# EAGLE design badge_03v3 (EAGLE 7.2.0)
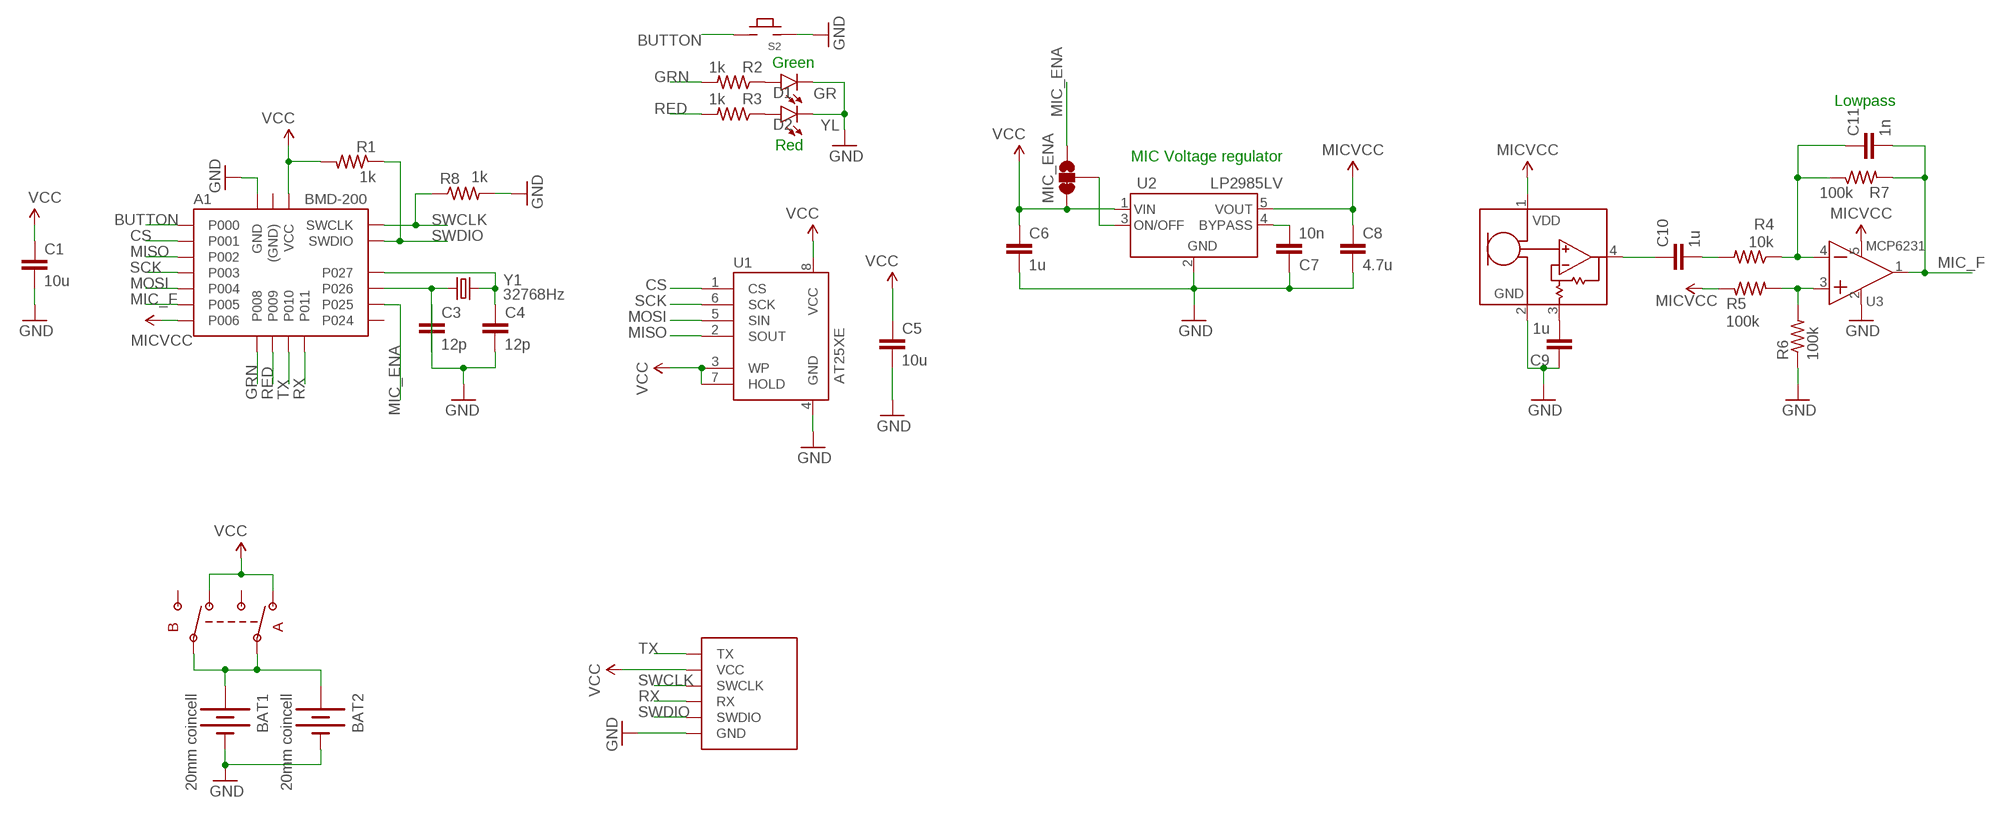
[diagram p0: schematic, sheet 1]

## Parts
A1  BMD-200  [BMD-200]
BAT1  20mm coincell  BATTERY20MM_ISO  [BATTCON_20MM_4LEGS_ISO]
BAT2  20mm coincell  BATTERY20MM_ISO_NOCREAM  [BATTCON_20MM_4LEGS_ISO_NOCREAM]
C1  10u  C-EUC0603  [C0603]
C3  12p  C-EUC0603  [C0603]
C4  12p  C-EUC0603  [C0603]
C5  10u  C-EUC0603  [C0603]
C6  1u  C-EUC0603  [C0603]
C7  10n  C-EUC0603  [C0603]
C8  4.7u  C-EUC0603  [C0603]
C9  1u  C-EUC0603  [C0603]
C10  1u  C-EUC0603  [C0603]
C11  1n  C-EUC0603  [C0603]
D1  GR  LED  [LED-0603]
D2  YL  LED  [LED-0603]
J1  PROG_CONN_6  [TH_CONN_6]
MIC_ENA  JUMPER-PAD-3-2OF3_NC_BY_TRACE_SMALL  [PAD-JUMPER-3-2OF3_NC_BY_TRACE_YES_SILK_FULL_BOX]
MK1  SPU0414(AMP)  [MIC_SPU041X]
R1  1k  R-US_R0603  [R0603]
R2  1k  R-US_R0603  [R0603]
R3  1k  R-US_R0603  [R0603]
R4  10k  R-US_R0603  [R0603]
R5  100k  R-US_R0603  [R0603]
R6  100k  R-US_R0603  [R0603]
R7  100k  R-US_R0603  [R0603]
R8  1k  R-US_R0603  [R0603]
S1  JS202011SCQN  [JS202011SCQN]
S2  TACT6MM4  [TACT1]
U1  AT25XE  AT25_SOIC  [SOIC8]
U2  LP2985LV  [SOT23-5L]
U3  MCP6231  [SOT23-5L]
Y1  32768Hz  CRYSTAL  [CRYSTAL_2SMD]

## Nets
BUTTON: A1.P$11(P000) S2.1 S2.2
CS: A1.P$12(P001) U1.1(CS)
GND: A1.P$1(GND) A1.P$2(GND) A1.P$3(GND) A1.P$4(GND) A1.P$7(GND) A1.P$10(GND) A1.P$19(GND) A1.P$26(GND) BAT1.NEG(-) BAT2.NEG(-) C1.2 C3.1 C4.2 C5.2 C6.2 C7.1 C8.2 C9.1 D1.C D2.C J1.GND MK1.2(GND) R6.1 R8.2 S2.3 S2.4 U1.4(GND) U2.2(GND) U3.2(GND)
GRN: A1.P$20(P008) R2.2
MIC_ENA: A1.P$6(P025) MIC_ENA.1
MIC_F: A1.P$16(P005) C11.2 R7.2 U3.1(O)
MICVCC: A1.P$17(P006) C8.1 MK1.1(VDD) R5.1 U2.5(VOUT) U3.5(VDD)
MISO: A1.P$13(P002) U1.2(SOUT)
MOSI: A1.P$15(P004) U1.5(SIN)
N$2: A1.P$8(P026) C3.2 Y1.P$2
N$3: D1.A R2.1
N$4: D2.A R3.1
N$6: MIC_ENA.2 U2.3(ON/OFF)
N$7: C9.2 MK1.3(GAIN)
N$8: A1.P$9(P027) C4.1 Y1.P$1
N$9: C7.2 U2.4(BYPASS)
N$10: R5.2 R6.2 U3.3(+)
N$11: C10.1 MK1.4(OUT)
N$13: C10.2 R4.2
N$14: C11.1 R4.1 R7.1 U3.4(-)
RED: A1.P$21(P009) R3.2
RX: A1.P$23(P011) J1.RX
SCK: A1.P$14(P003) U1.6(SCK)
SWCLK: A1.P$25(SWCLK) J1.SWCLK R8.1
SWDIO: A1.P$24(SWDIO) J1.SWDIO R1.1
TX: A1.P$22(P010) J1.TX
VBATT: BAT1.1(+) BAT1.2(+) BAT1.3(+) BAT1.4(+) BAT2.1(+) BAT2.2(+) BAT2.3(+) BAT2.4(+) S1.AC S1.BC
VCC: A1.P$18(VCC) C1.1 C5.1 C6.1 J1.VCC MIC_ENA.3 R1.2 S1.A1 S1.B1 U1.3(WP) U1.7(HOLD) U1.8(VCC) U2.1(VIN)
Unconnected: A1.P$5(P024) A1.P$27((GND)) A1.P$28((GND)) S1.A2 S1.B2

## Notes on the sheet
- Green
- Lowpass
- Red
- MIC Voltage regulator

## Library data of the parts
A1 = rigado_BMD-200:BMD-200
BAT1 BAT2 = Badge:BATTERY: Battery Holders Various common sizes : AA, AAA, 18650 (PRT-12895), 20mm coin cell and 12mm coin cell. 20MM_4LEGS, BATT-10373
C1 C3-C11 = rcl:C-EU: CAPACITOR, European symbol
D1 D2 = Badge:LED
J1 = Badge:PROG_CONN_6
MIC_ENA = Badge:JUMPER-PAD-3-2OF3_NC_BY_TRACE
MK1 = Badge:SPU0414(AMP)
R1-R8 = rcl:R-US_: RESISTOR, American symbol
S1 = Badge:JS202011SCQN
S2 = Badge:TACT
U1 = Badge:AT25
U2 = Badge:LP2985LV
U3 = Badge:MCP6231
Y1 = Badge:CRYSTAL

## Board
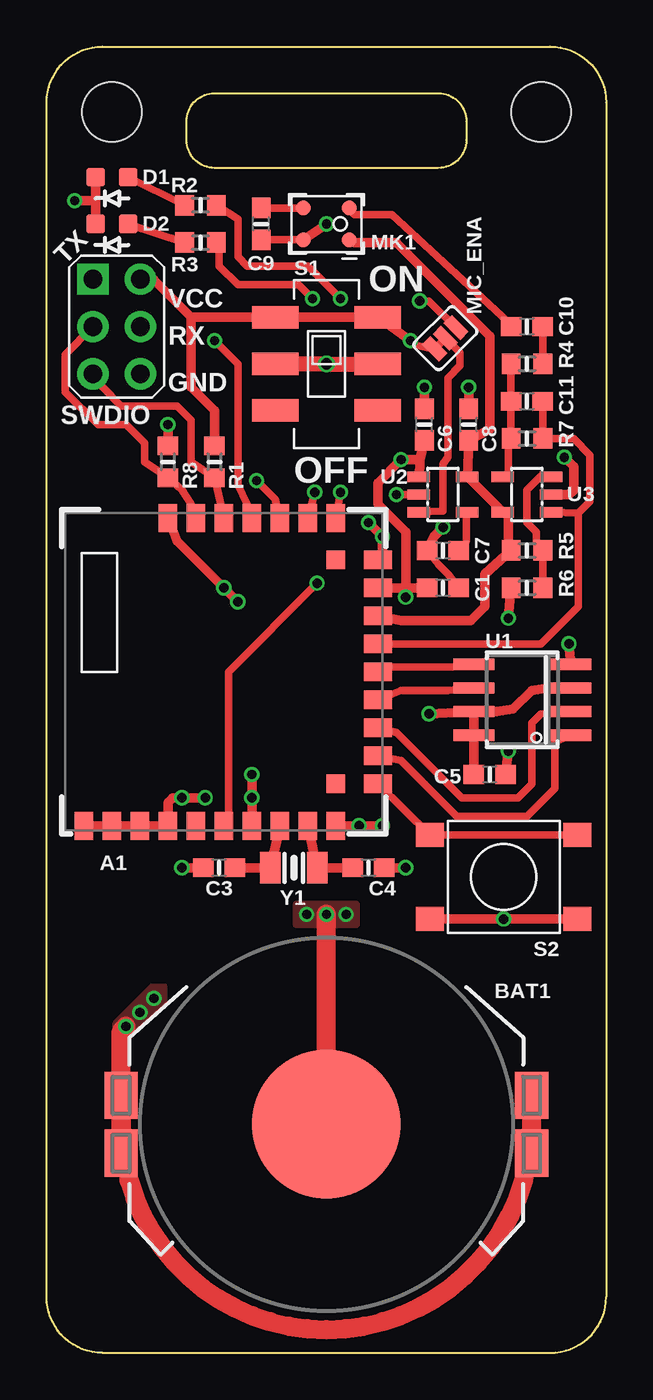
[diagram p1: board, top side]
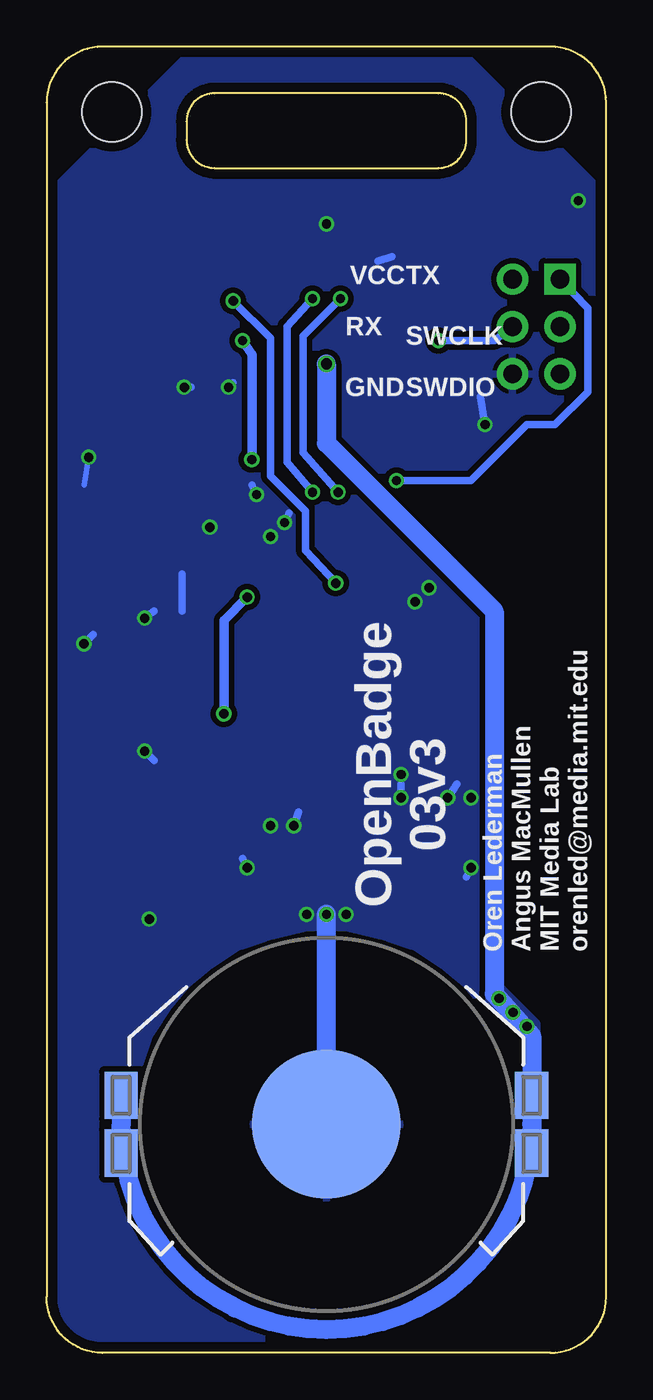
[diagram p2: board, bottom side, seen from below]

Size 30 x 70 mm. Coordinates in mm from the lower left corner, seen from the top.
Outline: 3,0 27,0 arc90 30,3 30,67 arc90 27,70 3,70 arc90 0,67 0,3 arc90 3,0
Outline: 9,67.5 21,67.5 arc-90 22.5,66 22.5,65 arc-90 21,63.5 9,63.5 arc-90 7.5,65 7.5,66 arc-90 9,67.5
Copper layers (1*16): Top 0.035mm / dielectric 1.5mm / Bottom 0.035mm
Design rules "ITEADstudio_DRC - oren *": minimum track width 6mil, minimum drill 12mil, track to track 6mil, track to pad 6mil, pad to pad 6mil, via to via 6mil, smd to smd 0mil, copper to edge 20mil, drill to drill 20mil, minimum pad ring 10mil, minimum via ring 6mil, stop-mask expansion 2mil, vias tented up to drill 100mil, thermal gap 10mil
Holes 3.2 mm at 3.5,66.5 26.5,66.5

### Footprints (pad centres in the part's own frame; a part is rotated, then mirrored left to right if it is on the bottom)
BMD-200 = smd 1.5 x 1: P$1 -8.25,7.5; P$2 -8.25,6; P$3 -8.25,4.5; P$4 -8.25,3; P$5 -8.25,1.5; P$6 -8.25,0; P$7 -8.25,-1.5; P$8 -8.25,-3; P$9 -8.25,-4.5; P$10 -8.25,-6; P$20 8.25,-6; P$21 8.25,-4.5; P$22 8.25,-3; P$23 8.25,-1.5; P$24 8.25,0; P$25 8.25,1.5; P$26 8.25,3 | smd 1 x 1.5: P$11 -6,-8.25; P$12 -4.5,-8.25; P$13 -3,-8.25; P$14 -1.5,-8.25; P$15 0,-8.25; P$16 1.5,-8.25; P$17 3,-8.25; P$18 4.5,-8.25; P$19 6,-8.25 | smd 1 x 1: P$27 -6,-6; P$28 6,-6
BATTCON_20MM_4LEGS_ISO = smd 1.778 x 2.54: 1 -11,1.55; 2 -11,-1.55; 3 11,1.55; 4 11,-1.55 | smd 8 x 8: NEG 0,0
BATTCON_20MM_4LEGS_ISO_NOCREAM = smd 1.778 x 2.54: 1 -11,1.55; 2 -11,-1.55; 3 11,1.55; 4 11,-1.55 | smd 8 x 8: NEG 0,0
C0603 = smd 1.1 x 1: 1 -0.85,0; 2 0.85,0
LED-0603 = smd 1 x 1: A 0.877,0; C -0.877,0
TH_CONN_6 = drill 1 pad 1.676: GND 1.27,-2.54; RX 1.27,0; SWCLK -1.27,0; SWDIO -1.27,-2.54; VCC 1.27,2.54 | drill 1 pad 1.676 square: TX -1.27,2.54
PAD-JUMPER-3-2OF3_NC_BY_TRACE_YES_SILK_FULL_BOX = smd 0.635 x 1.27: 1 -0.813,0; 2 0,0; 3 0.813,0
MIC_SPU041X = smd 0.8 x 0.8: 1 -1.23,0.85; 2 1.23,0.85; 3 1.23,-0.85; 4 -1.23,-0.85
R0603 = smd 1 x 1.1: 1 -0.85,0; 2 0.85,0
JS202011SCQN = smd 2.5 x 1.2: A1 2.75,2.5; A2 2.75,-2.5; AC 2.75,0; B1 -2.75,2.5; B2 -2.75,-2.5; BC -2.75,0
TACT1 = smd 1.5 x 1.3: 1 -3.95,2.25; 2 3.95,2.25; 3 -3.95,-2.25; 4 3.95,-2.25
SOIC8 = smd 2.2 x 0.6: 1 -2.6,1.905; 2 -2.6,0.635; 3 -2.6,-0.635; 4 -2.6,-1.905; 5 2.6,-1.905; 6 2.6,-0.635; 7 2.6,0.635; 8 2.6,1.905
SOT23-5L = smd 1.2 x 0.55: 1 -1.3,0.95; 2 -1.3,0; 3 -1.3,-0.95; 4 1.3,-0.95; 5 1.3,0.95
CRYSTAL_2SMD = smd 1.1 x 1.7: P$1 -1.25,0; P$2 1.25,0

### Placement (x,y rotation side)
A1  9.5,36.5 90 top
BAT1  15,12.25 0 top
BAT2  15,12.25 0 bottom
C1  21.25,41 0 top
C3  9.25,26 0 top
C4  17.25,26 0 top
C5  23.75,31 0 top
C6  20.25,49.75 90 top
C7  21.25,43 0 top
C8  22.62,49.75 90 top
C9  11.5,60.5 90 top
C10  25.75,55 0 top
C11  25.75,51 0 top
D1  3.5,63 0 top
D2  3.5,60.5 0 top
J1  3.75,55 0 top
MIC_ENA  21.38,54.38 225 top
MK1  15,60.5 180 top
R1  9,47.75 90 top
R2  8.25,61.5 0 top
R3  8.25,59.5 0 top
R4  25.75,53 0 top
R5  25.75,43 0 top
R6  25.75,41 0 top
R7  25.75,49 0 top
R8  6.5,47.75 90 top
S1  15,53 0 top
S2  24.5,25.5 0 top
U1  25.5,35 180 top
U2  21.25,46 0 top
U3  25.75,46 180 top
Y1  13.25,26 180 top

### Tracks (layer width: path | path; a pad name or v marks a point on that pad's centre or on a via)
BUTTON
  Top 0.406: A1.P$11 S2.1 S2.2
CS
  Top 0.406: A1.P$12 19,31.75 22,28.75 25.75,28.75 27.25,30.25 27.25,32.75 U1.1
GND  (via drill 0.5)
  Top 0.406: A1.P$19 18,43 | U2.2 v18.75,46 | C9.1 MK1.2 | C1.2 21.5,41.75 21,42.25 C7.1
  Top 0.508: U3.2 28,46 28.25,46.25 28.25,47.5 v27.75,48 | C3.1 v7.25,26 | A1.P$7 v11,29.75 v11,31 | C4.2 v19.25,26 | A1.P$1 A1.P$2 A1.P$3 A1.P$4 6.5,29.5 6.75,29.75 v7.25,29.75 v8.5,29.75 | R6.1 v24.75,39.38 | 18,43 v18,43.75 v17.25,44.5 | A1.P$26 7,43.5 v9.5,41 v10.25,40.25 | C6.2 v20.25,51.75 | C8.2 v22.62,51.75 | v15,60.5 MK1.2 | C5.2 v24.75,32.25 | U1.4 v28,38 | S2.4 v24.5,23.25 S2.3 | v21.25,44.25 20.75,43.75 C7.1 | R8.2 v6.5,49.75 | D1.C 2.62,61.75 | 2.62,61.75 D2.C | v1.5,61.75 2.62,61.75 | A1.P$10 v16.75,28.25 v18,28.25
  Top 1.016: BAT2.NEG v15,23.5
  Bottom 0.305: v27.75,48 28,46.5
  Bottom 0.406: v7.25,26 7.5,25.5 | v11,29.75 11,30.5 | v16.75,28.25 16.5,29 | v19.25,26 19.5,26.5 | v24.75,39.38 24.25,39.75 | 22.75,41.75 22.75,39.75 | v17.25,44.5 17,45 | v8.5,29.75 8,30.5 | 11.5,58.75 12.25,58.5 | v20.25,51.75 20,52 | v22.62,51.75 22.25,51.75 | v18.75,46 19,46.5 | v24.75,32.25 24.25,31.75 | v28,38 27.5,38.5 | v6.5,49.75 6.75,51.25
  Bottom 1.016: BAT2.NEG v15,23.5
  other vias: 16.06,23.5 13.94,23.5
  pour Bottom (isolate 0.3, rank 2): 0,62 0,0 30,0 30,62 22,70 8,70
  pour Top: 13.41,22.97 13.41,24.03 16.59,24.03 16.59,22.97
GRN  (via drill 0.5)
  Top 0.406: A1.P$20 v15.75,46.12 | R2.2 10.25,60.75 10.25,58.75 10.75,58.25 14,58.25 v15.75,56.5
  Bottom 0.406: v15.75,46.12 17.12,47.75 17.12,55 v15.75,56.5
MIC_ENA  (via drill 0.5)
  Top 0.406: A1.P$6 9.75,29 9.75,36.5 v14.5,41.25 | MIC_ENA.1 20.5,56.38 v20,56.38
  Bottom 0.406: v20,56.38 18,54.38 18,47 16.12,45.12 16.12,43 v14.5,41.25
MIC_F
  Top 0.305: 26.88,49 R7.2
  Top 0.406: C11.2 R7.2 | U3.1 28.5,45 | 28.5,45 29.12,45.62 29.12,48.12 28.25,49 26.88,49 | A1.P$16 26.5,38 28.5,40 28.5,45
MICVCC
  Top 0.406: U3.5 24.75,44.75 | 24.75,42.75 R5.1
  Top 0.508: MK1.1 16.5,59.5 18.75,59.5 23.75,54.5 23.75,49.5 C8.1 U2.5 U3.5 | 24.75,44.75 24.75,42.75 | R5.1 23.5,41.75 23.5,40 22.75,39.25 19,39.25 A1.P$17
MISO
  Top 0.406: A1.P$13 18.75,33.25 22.25,29.75 25.25,29.75 26,30.5 26,33.75 26.5,34.25 U1.2
MOSI
  Top 0.406: A1.P$15 18.5,36.75 21.75,36.75 U1.5
N$2
  Top 0.508: A1.P$8 Y1.P$2 C3.2
N$3
  Top 0.406: D1.A R2.1
N$4
  Top 0.406: D2.A R3.1
N$6
  Top 0.406: U2.3 21.25,45.12 21.25,47.62 21.5,48 21.5,52.25 22.15,52.9 22.15,53.6 MIC_ENA.2
N$7
  Top 0.406: MK1.3 C9.2
N$8
  Top 0.508: A1.P$9 Y1.P$1 C4.1
N$9
  Top 0.406: U2.4 22.5,44.75 22.5,43.5 C7.2
N$10
  Top 0.305: U3.3 26.5,47 | 26.25,43.5 R5.2
  Top 0.406: R5.2 R6.2 | 26.5,47 25.75,46.25 25.75,44.5 26.25,44 26.25,43.5
N$11
  Top 0.406: MK1.4 16.5,61 18.5,61 24.75,55.25 C10.1
N$13
  Top 0.406: C10.2 R4.2
N$14
  Top 0.305: R7.1 24.75,48.5 | 24.75,47.25 U3.4
  Top 0.406: R4.1 C11.1 R7.1 | 24.75,48.5 24.75,47.25
RED  (via drill 0.5)
  Top 0.406: A1.P$21 v14.38,46.12 | R3.2 9.25,59 9.25,58.25 10.25,57.25 13.5,57.25 v14.25,56.5
  Bottom 0.406: v14.38,46.12 16.25,48.25 16.25,54.5 v14.25,56.5
RX  (via drill 0.5)
  Top 0.406: v9,54.25 10.25,53 10.25,46.5 10.75,45.5 A1.P$23
  Bottom 0.406: J1.RX 6,54.25 v9,54.25
SCK
  Top 0.406: A1.P$14 19,35.5 21.5,35.5 U1.6
SWCLK
  Top 0.406: J1.SWCLK 1,53.5 1,51.5 2.75,49.75 4.25,49.75 5.25,48.75 5.25,47.75 R8.1 7.25,46.25 7.75,45.5 A1.P$25
SWDIO
  Top 0.406: J1.SWDIO 3,51.75 4,50.75 7,50.75 7.75,50 7.75,47.75 R1.1 A1.P$24
TX  (via drill 0.5)
  Top 0.406: v11.25,46.75 12.25,45.75 A1.P$22
  Bottom 0.406: J1.TX 1,56 1,51.5 2.75,49.75 4.25,49.75 7.25,46.75 v11.25,46.75
VBATT  (via drill 0.5, 0.6)
  Top 0.813: S1.AC v15,53 S1.BC
  Top 1.016: BAT2.3 4,12.25 arc90 15,1.25 arc90 26,12.25 | 26,12.25 BAT2.1 | BAT2.2 26,12.25 | BAT2.3 4,17.25 | 4,17.25 arc90 v4.25,17.5 4,17.25 | BAT2.4 BAT2.3
  Bottom 1.016: v15,53 15,48.75 6,39.75 6,19.25 4,17 BAT2.3 4,12.25 | 4,12.25 arc90 15,1.25 arc90 26,12.25 | BAT2.1 26,12.25 | BAT2.2 26,12.25 | 4,12.25 BAT2.4
  other vias: 5,18.25 5.75,19
  pour Bottom (isolate 0.254): 4,17 4,17.5 6,19.5 6,19
  pour Top: 4,17 4,17.5 6,19.5 6,19
VCC  (via drill 0.5)
  Top 0.406: v19.5,54.25 19.75,54 MIC_ENA.3
  Top 0.508: A1.P$18 19.25,41 | C1.1 19.25,41 | 19.25,41 v19.25,40.5 19.25,44 17.75,45.5 17.75,46.62 v19,47.88 20,47.88 | C6.1 20,47.88 | 20,47.88 20,47.5 U2.1 | J1.VCC 5.75,57.5 7.75,55.5 | U1.3 26.88,35.62 26,35.5 25,34.5 24.12,34.38 U1.7 | v20.5,34.25 U1.7 | U1.7 U1.8 C5.1 | R1.2 9,50.5 7.75,51.75 7.75,55.5 | 7.75,55.5 S1.B1 S1.A1 v19.5,54.25
  Bottom 0.508: v19,47.88 19,53.5 v19.5,54.25 | v20.5,34.25 20.5,39.25 v19.25,40.5

### Text on the board
tPlace: TX | ON | VCC | RX | GND | SWDIO | OFF
bPlace: TX | VCC | SWCLK | RX | SWDIO | GND | OpenBadge / 03v3 | Oren Lederman / Angus MacMullen / MIT Media Lab / orenled@media.mit.edu